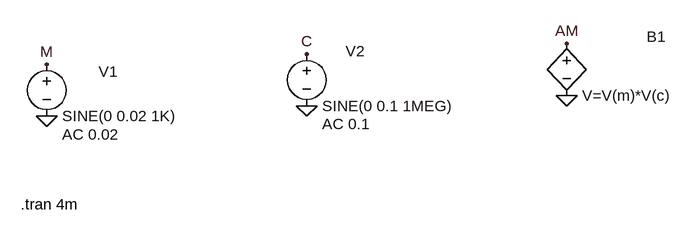
[diagram p0: schematic 10.asc]
10.asc, the LTspice schematic file:
Version 4
SHEET 1 880 680
FLAG -192 224 0
FLAG 208 208 0
FLAG 608 192 0
FLAG -192 144 M
FLAG 208 128 C
FLAG 608 112 AM
SYMBOL voltage -192 128 R0
WINDOW 0 80 27 Left 2
WINDOW 123 24 124 Left 2
WINDOW 39 0 0 Left 0
SYMATTR InstName V1
SYMATTR Value SINE(0 0.02 1K)
SYMATTR Value2 AC 0.02
SYMBOL voltage 208 112 R0
WINDOW 0 60 12 Left 2
WINDOW 123 24 124 Left 2
WINDOW 39 0 0 Left 0
SYMATTR InstName V2
SYMATTR Value SINE(0 0.1 1MEG)
SYMATTR Value2 AC 0.1
SYMBOL bv 608 96 R0
WINDOW 0 123 5 Left 2
SYMATTR InstName B1
SYMATTR Value V=V(m)*V(c)
TEXT -232 360 Left 2 !.tran 4m

The netlist it stands for:
* 10.asc
V1 M 0 SINE(0 0.02 1K) AC 0.02
V2 C 0 SINE(0 0.1 1MEG) AC 0.1
B1 AM 0 V=V(m)*V(c)
.tran 4m
.backanno
.end